# Altium schematic sheet power.SchDoc
size A4
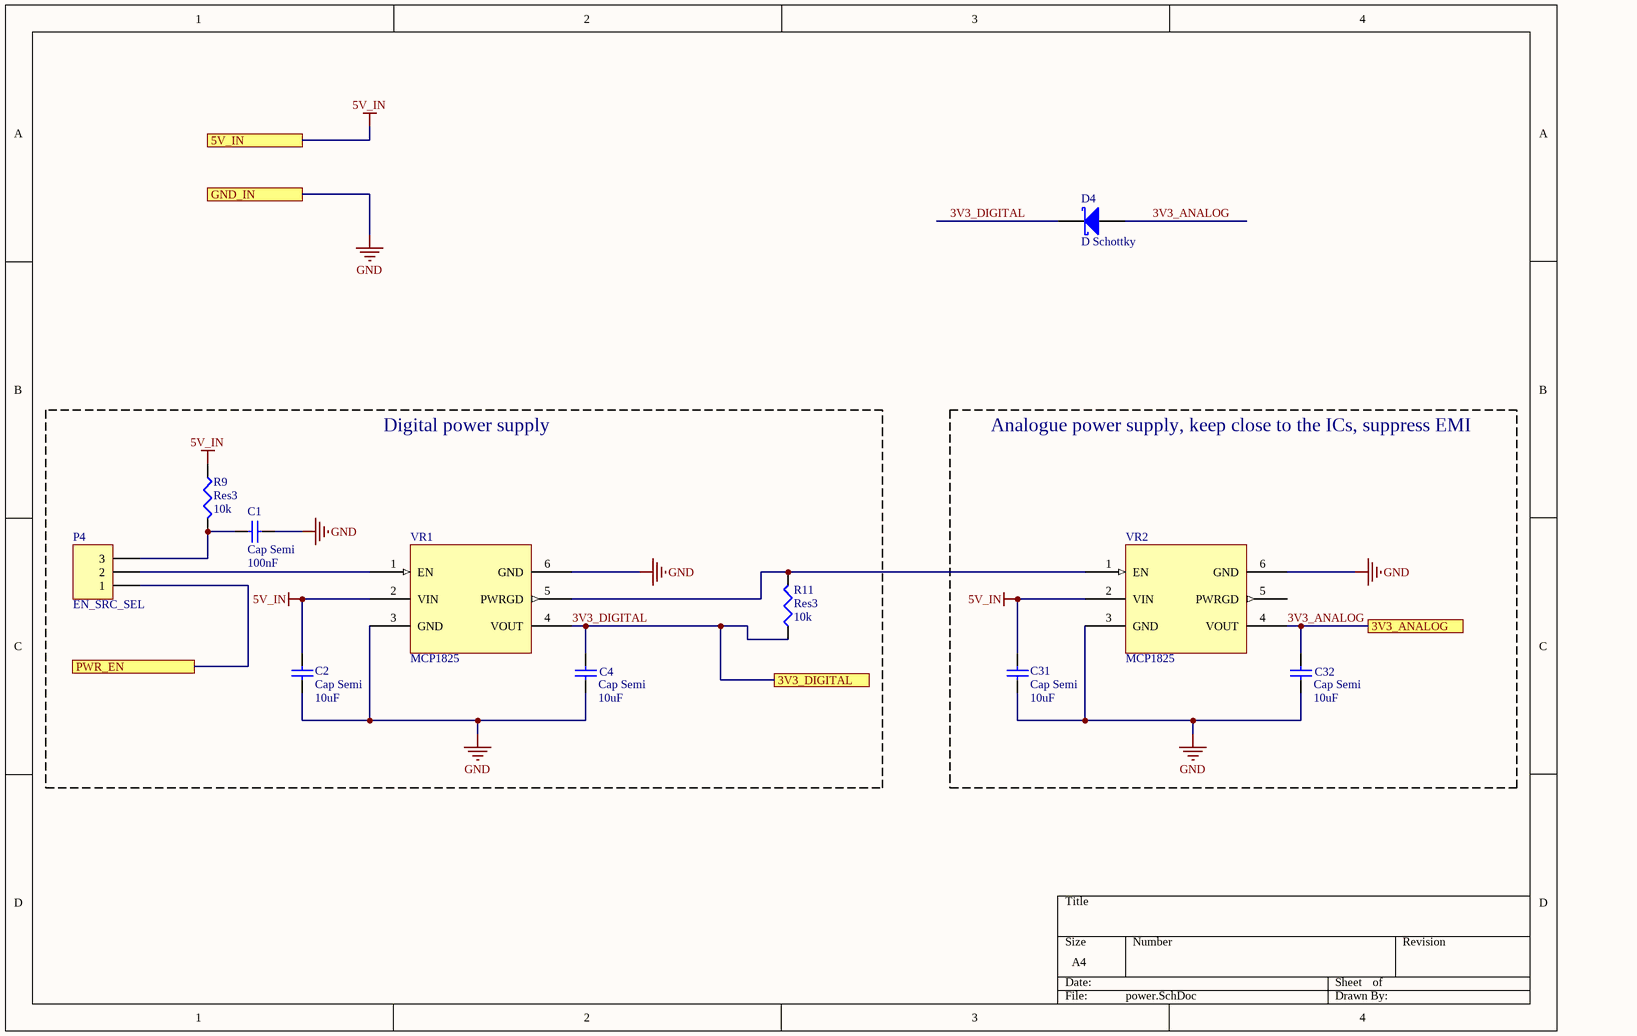
[diagram p0: power.SchDoc]

## Parts
C1  Cap Semi  value 100nF  [C1206]
C2  Cap Semi  value 10uF  [C1210]
C4  Cap Semi  value 10uF  [C1210]
C31  Cap Semi  value 10uF  [C1210]
C32  Cap Semi  value 10uF  [C1210]
D4  D Schottky  [SMB]
P4  EN_SRC_SEL  [HDR1X3]
R9  Res3  value 10k  [J1-0603]
R11  Res3  value 10k  [J1-0603]
VR1  MCP1825  [SOT-223-6]
VR2  MCP1825  [SOT-223-6]

## Blocks framed on the sheet
Digital power supply: C1 C2 C4 P4 R9 R11 VR1
Analogue power supply, keep close to the ICs, suppress EMI: C31 C32 VR2

## Ports
3V3_ANALOG, 3V3_DIGITAL, 5V_IN, GND_IN, PWR_EN

## Nets
5V_IN: C2.2 C31.2 R9.1 VR1.2(VIN) VR2.2(VIN) ; port 5V_IN
GND: C1.1 C2.1 C4.1 C31.1 C32.1 VR1.3(GND) VR1.6(GND) VR2.3(GND) VR2.6(GND) ; port GND_IN
3V3_ANALOG: C32.2 D4.1(A) VR2.4(VOUT) ; port 3V3_ANALOG
3V3_DIGITAL: C4.2 D4.2(K) R11.1 VR1.4(VOUT) ; port 3V3_DIGITAL
PWR_EN: P4.1 ; port PWR_EN
NetC1_2: C1.2 P4.3 R9.2
NetP4_2: P4.2 VR1.1(EN)
NetR11_2: R11.2 VR1.5(PWRGD) VR2.1(EN)

Not connected (* = marked no-connect by the designer): VR2 5(PWRGD)

## Library data of the parts
C1 C2 C4 C31 C32 = Cap Semi: Capacitor (Semiconductor SIM Model); Published: 8-Jun-2000; LatestRevisionDate: 29-May-2009; LatestRevisionNote: IPC-7351 Footprint Added.; PackageReference: C1206; Publisher: Altium Limited; PackageDescription: Chip Capacitor
D4 = D Schottky: Schottky Diode; Published: 8-Jun-2000; LatestRevisionDate: 17-Jul-2002; LatestRevisionNote: Re-released for DXP Platform.; PackageReference: SMB; Publisher: Altium Limited; PackageDescription: DO-214-AA/SMB; 2 C-Bend Leads; Body 5.3 x 3.6 mm, inc. leads (LxW); Code_JEDEC: DO-214-AA
P4 = Header 3: Header, 3-Pin; LatestRevisionDate: 17-Jul-2002; LatestRevisionNote: Re-released for DXP Platform.; Publisher: Altium Limited
R9 R11 = Res3: Resistor; Published: 8-Jun-2000; LatestRevisionDate: 29-May-2009; LatestRevisionNote: IPC-7351 Footprint Added.; PackageReference: J1-0603; Publisher: Altium Limited; PackageDescription: Chip Resistor
VR1 VR2 = MCP1825: 3.3V Voltage regulator